# Altium schematic sheet servo_pwr.SchDoc: Servo power board
size A4; Organization: W Burdecki; Address1: github.com/wiciu15; Address2: All rights reserved; DocumentNumber: 1; Revision: 1.0; SheetNumber: 1; SheetTotal: 3
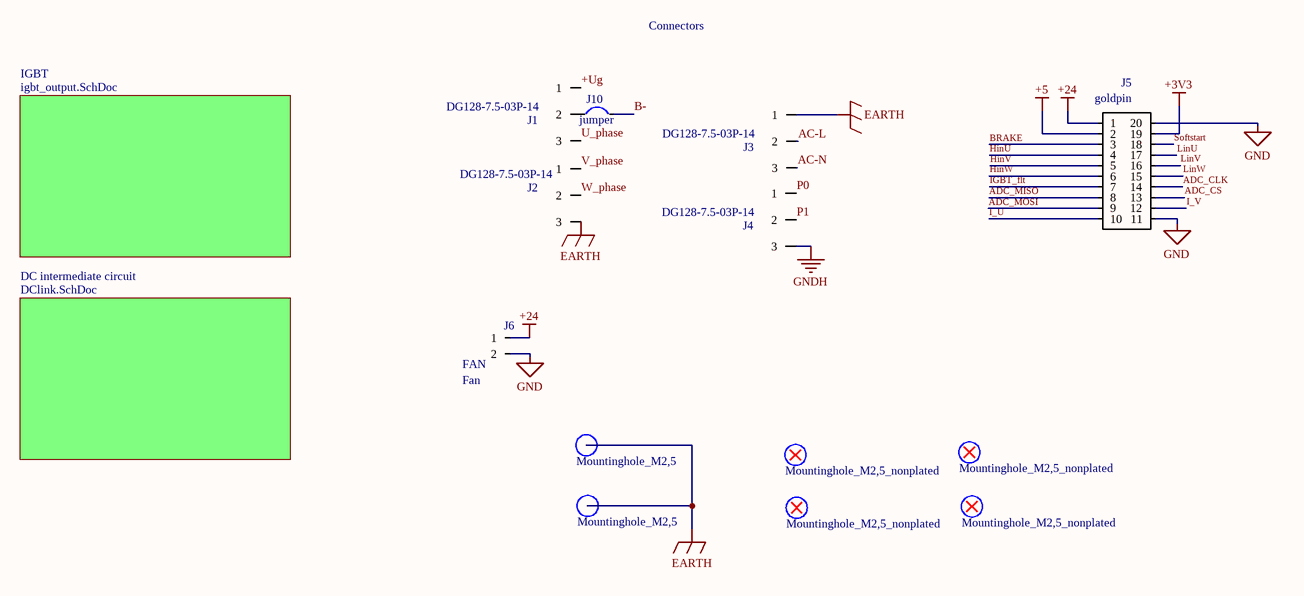
[diagram p0: servo_pwr.SchDoc]

## Parts
J1  DG128-7.5-03P-14  [DG128-7.5-03P-14]
J2  DG128-7.5-03P-14  [DG128-7.5-03P-14]
J3  DG128-7.5-03P-14  [DG128-7.5-03P-14]
J4  DG128-7.5-03P-14  [DG128-7.5-03P-14]
J5  goldpin  [goldpin 2x10]
J6  FAN  [JST XH 2pin]
J10  jumper  [Jumper]
MH3  Mountinghole_M2,5  [Mountinghole M2,5]
MH4  Mountinghole_M2,5  [Mountinghole M2,5]
MH5  Mountinghole_M2,5_nonplated  [Mountinghole M2,5 non plated]
MH6  Mountinghole_M2,5_nonplated  [Mountinghole M2,5 non plated]
MH7  Mountinghole_M2,5_nonplated  [Mountinghole M2,5 non plated]
MH8  Mountinghole_M2,5_nonplated  [Mountinghole M2,5 non plated]

## Sub-sheets
DC intermediate circuit = DClink.SchDoc: no entries
IGBT = igbt_output.SchDoc: no entries

## Nets
+3V3: J5.19
+5: J5.2
+24: J5.1 J6.1
EARTH: J2.3 J3.1 MH3.1 MH4.1
GND: J5.11 J5.20 J6.2
GNDH: J4.3
+Ug: J1.1
AC-L: J3.2
AC-N: J3.3
ADC_CLK: J5.14
ADC_CS: J5.13
ADC_MISO: J5.8
ADC_MOSI: J5.9
B-: J10.1
BRAKE: J5.3
HinU: J5.4
HinV: J5.5
HinW: J5.6
I_U: J5.10
I_V: J5.12
IGBT_flt: J5.7
LinU: J5.17
LinV: J5.16
LinW: J5.15
P0: J4.1
P1: J4.2
Softstart: J5.18
U_phase: J1.3
V_phase: J2.1
W_phase: J2.2
NetJ1_2: J1.2 J10.2

Not connected (* = marked no-connect by the designer): MH5 1*; MH6 1*; MH7 1*; MH8 1*

## Notes on the sheet
- Connectors
- (near J6) Fan
- Title
- Size:
- Date:
- A4
- Number:
- Time:
- Revision:
- Sheet
- of
- File:

## Library data of the parts
J6 = JST 2pin